# EAGLE design NodeArch_v2 (EAGLE 8.5.2)
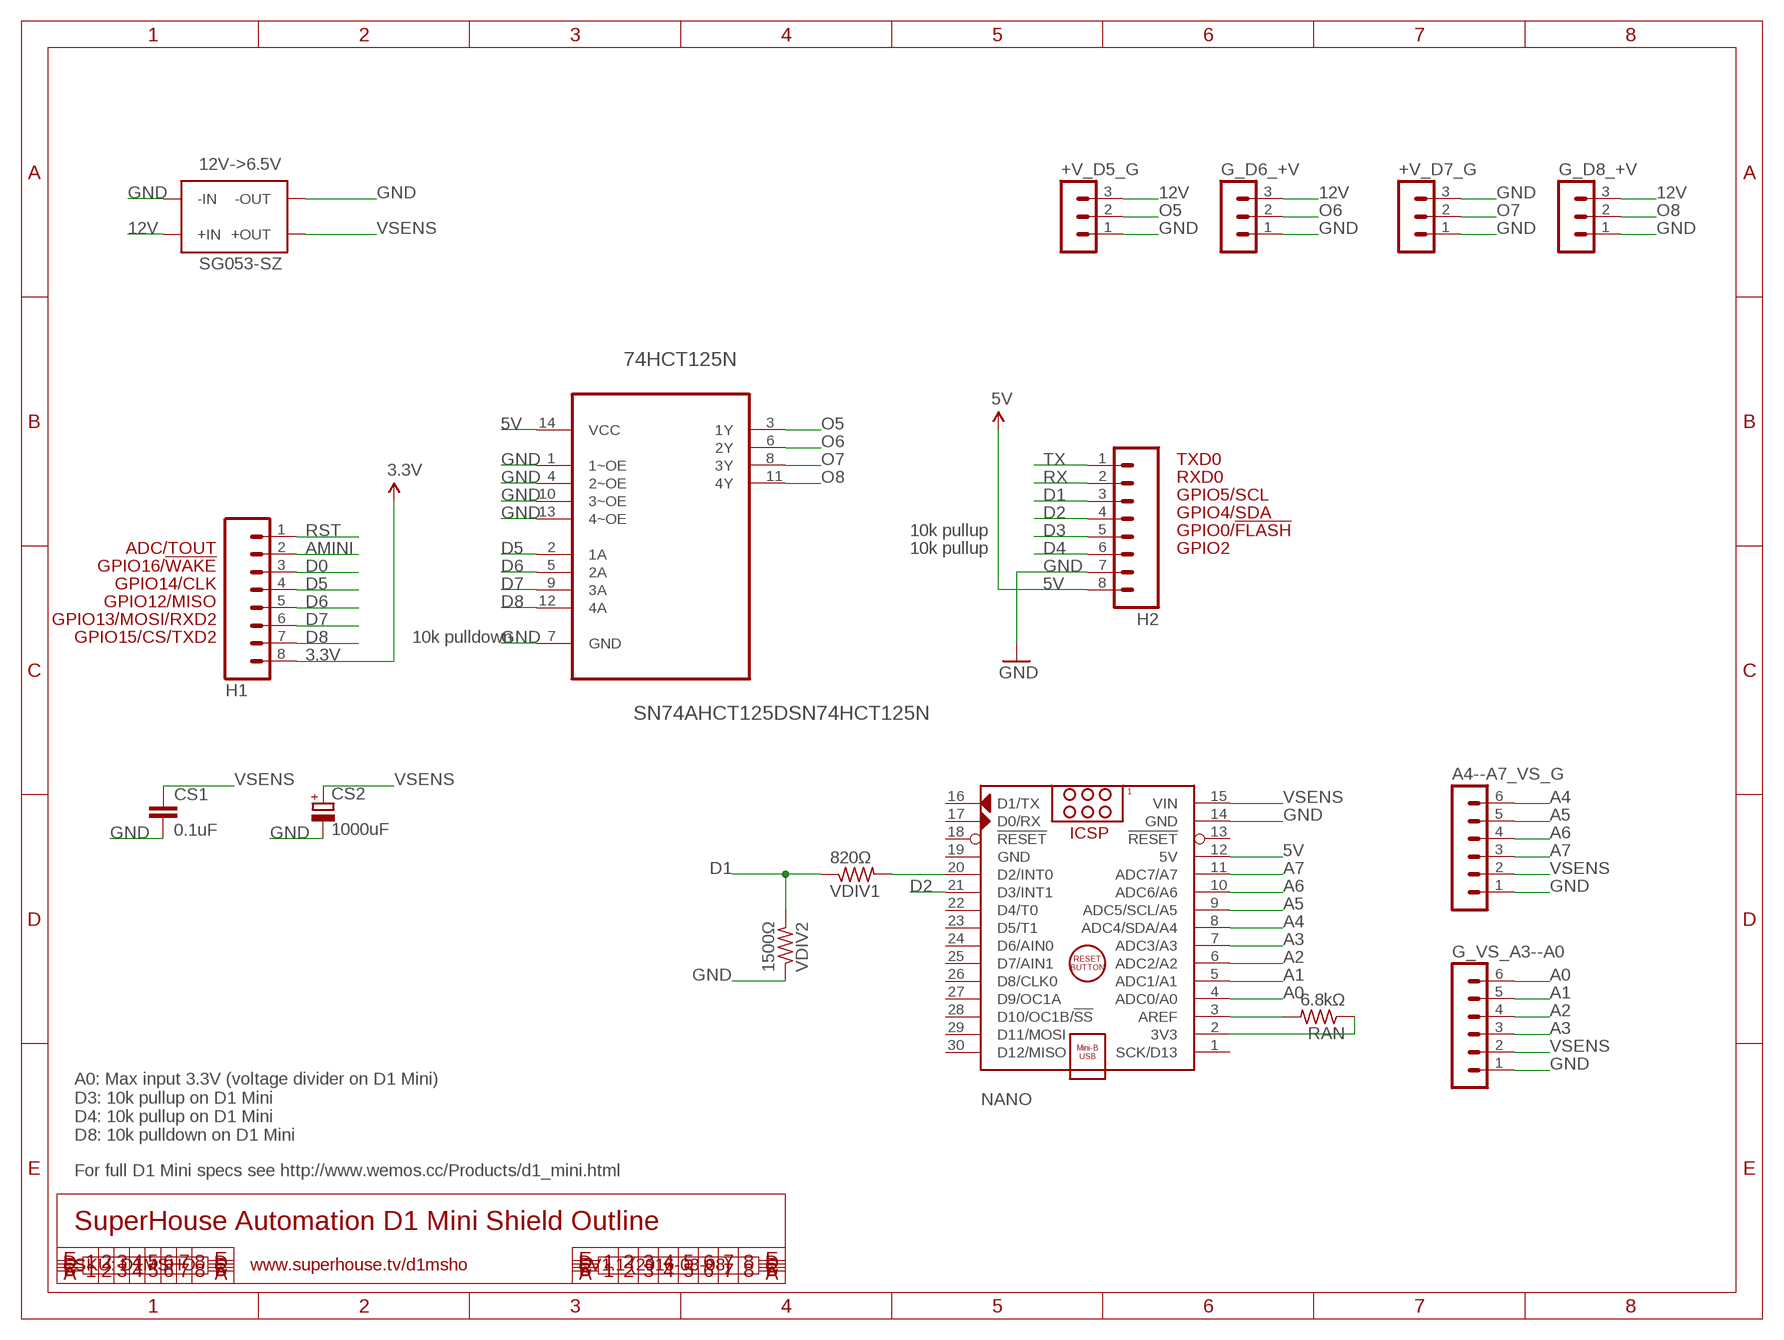
[diagram p0: schematic, sheet 1]

## Parts
12V->6.5V  SG053-SZ  [SG053-SZ]
74HCT125N  SN74AHCT125DSN74HCT125N  [DIP254P762X508-14]
+V_D5_G  MA03-1  [MA03-1]
+V_D7_G  MA03-1  [MA03-1]
A4--A7_VS_G  MA06-1  [MA06-1]
CS1  0.1uF  C-EU025-025X050  [C025-025X050]
CS2  1000uF  CPOL-EUE5-10.5  [E5-10,5]
G_D6_+V  MA03-1  [MA03-1]
G_D8_+V  MA03-1  [MA03-1]
G_VS_A3--A0  MA06-1  [MA06-1]
H1  M08  [1X08]
H2  M08  [1X08]
NANO  ARDUINO_NANO  [ARDUINO_NANO]
RAN  6.8kΩ  R-US_0207/2V  [0207/2V]
VDIV1  820Ω  R-US_0207/2V  [0207/2V]
VDIV2  1500Ω  R-US_0207/2V  [0207/2V]

## Nets
3.3V: H1.8
5V: 74HCT125N.14(VCC) H2.8 NANO.12(5V)
12V [power]: 12V->6.5V.P$3(+IN) 12V->6.5V.P$4(+IN) +V_D5_G.3 G_D6_+V.3 G_D8_+V.3
A0: G_VS_A3--A0.6 NANO.4(ADC0/A0)
A1: G_VS_A3--A0.5 NANO.5(ADC1/A1)
A2: G_VS_A3--A0.4 NANO.6(ADC2/A2)
A3: G_VS_A3--A0.3 NANO.7(ADC3/A3)
A4: A4--A7_VS_G.6 NANO.8(ADC4/SDA/A4)
A5: A4--A7_VS_G.5 NANO.9(ADC5/SCL/A5)
A6: A4--A7_VS_G.4 NANO.10(ADC6/A6)
A7: A4--A7_VS_G.3 NANO.11(ADC7/A7)
AMINI: H1.2
D0: H1.3
D1: H2.3 VDIV1.1 VDIV2.2
D2: H2.4 NANO.21(D3/INT1)
D3: H2.5
D4: H2.6
D5: 74HCT125N.2(1A) H1.4
D6: 74HCT125N.5(2A) H1.5
D7: 74HCT125N.9(3A) H1.6
D8: 74HCT125N.12(4A) H1.7
GND [power]: 12V->6.5V.P$1(-IN) 12V->6.5V.P$2(-IN) 12V->6.5V.P$7(-OUT) 12V->6.5V.P$8(-OUT) 74HCT125N.1(1~OE) 74HCT125N.4(2~OE) 74HCT125N.7(GND) 74HCT125N.10(3~OE) 74HCT125N.13(4~OE) +V_D5_G.1 +V_D7_G.1 +V_D7_G.3 A4--A7_VS_G.1 CS1.2 CS2.- G_D6_+V.1 G_D8_+V.1 G_VS_A3--A0.1 H2.7 NANO.14(GND) VDIV2.1
N$1: NANO.3(AREF) RAN.2
N$2: NANO.2(3V3) RAN.1
N$3: NANO.20(D2/INT0) VDIV1.2
O5: 74HCT125N.3(1Y) +V_D5_G.2
O6: 74HCT125N.6(2Y) G_D6_+V.2
O7: 74HCT125N.8(3Y) +V_D7_G.2
O8: 74HCT125N.11(4Y) G_D8_+V.2
RST: H1.1
RX: H2.2
TX: H2.1
VSENS: 12V->6.5V.P$5(+OUT) 12V->6.5V.P$6(+OUT) A4--A7_VS_G.2 CS1.1 CS2.+ G_VS_A3--A0.2 NANO.15(VIN)
Unconnected: NANO.1(SCK/D13) NANO.13(!RESET) NANO.16(D1/TX) NANO.17(D0/RX) NANO.18(!RESET) NANO.22(D4/T0) NANO.23(D5/T1) NANO.24(D6/AIN0) NANO.25(D7/AIN1) NANO.26(D8/CLK0) NANO.27(D9/OC1A) NANO.28(D10/OC1B/!SS) NANO.29(D11/MOSI) NANO.30(D12/MISO)

## Notes on the sheet
- TXD0
- RXD0
- GPIO5/SCL
- GPIO4/SDA
- 10k pullup | GPIO0/!FLASH
- ADC/TOUT | 10k pullup | GPIO2
- GPIO16/!WAKE
- GPIO14/CLK
- GPIO12/MISO
- GPIO13/MOSI/RXD2
- GPIO15/CS/TXD2 | 10k pulldown
- A0: Max input 3.3V (voltage divider on D1 Mini)
  D3: 10k pullup on D1 Mini
  D4: 10k pullup on D1 Mini
  D8: 10k pulldown on D1 Mini
- For full D1 Mini specs see http://www.wemos.cc/Products/d1_mini.html
- SuperHouse Automation D1 Mini Shield Outline
- SKU: D1MSHO | www.superhouse.tv/d1msho | V1.1 (2016-03-08)

## Power pins joined to a net without a drawn wire
GND: NANO.19(GND)

## Library data of the parts
12V->6.5V = 1484249208697-powermodules:SG053-SZ
74HCT125N = parts:SN74AHCT125D: QUADRUPLE BUS BUFFER GATES WITH 3-STATE OUTPUTS
+V_D5_G +V_D7_G G_D6_+V G_D8_+V = con-lstb:MA03-1: PIN HEADER; OC_FARNELL: unknown; OC_NEWARK: unknown
A4--A7_VS_G G_VS_A3--A0 = con-lstb:MA06-1: PIN HEADER; OC_FARNELL: unknown; OC_NEWARK: unknown
CS1 = rcl:C-EU: CAPACITOR, European symbol; SPICEPREFIX: C
CS2 = resistor:CPOL-EU: POLARIZED CAPACITOR, European symbol
H1 H2 = freetronics-original:M08: Header 8 Standard 8-pin 0.1" header. Use with straight break away headers (SKU : PRT-00116), right angle break away headers (PRT-00553), swiss pins (PRT-00743), machine pins (PRT-00117), and female headers (PRT-00115).
NANO = ArduinoNanoV30:ARDUINO_NANO: Arduino Nano V3.0 Module Overview: The Arduino Nano is a small, complete, and breadboard-friendly board based on the ATmega328 (Arduino Nano 3.x) or ATmega168 (Arduino Nano 2.x). It has more or less the same functionality of the Arduino Duemilanove, but in a different package. It lacks only a DC power jack, and works with a Mini-B USB cable instead of a standard one. The Nano was designed and is being produced by Gravitech <http://www.gravitech.us/arna30wiatp.html>. General specifications: Item Value Microcontroller Atmel ATmega168 or ATmega328 Operating Voltage (logic level) 5 V Input Voltage (recommended) 7-12 V Input Voltage (limits) 6-20 V Digital I/O Pins 14 (of which 6 provide PWM output) Analog Input Pins 8 DC Current per I/O Pin 40 mA Flash Memory 16 KB (ATmega168) or 32 KB (ATmega328) of which 2 KB used by bootloader SRAM 1 KB (ATmega168) or 2 KB (ATmega328) EEPROM 512 bytes (ATmega168) or 1 KB (ATmega328) Clock Speed 16 MHz Dimensions (Inches) 0.73" x 1.70" Dimensions (mm) 18mm x 45mm Overall height About 9 mm (not including pins) Weigth 5 g Power: The Arduino Nano can be powered via the Mini-B USB connection, 6-20V unregulated external power supply (pin 30), or 5V regulated external power supply (pin 27). The power source is automatically selected to the highest voltage source. Memory: The ATmega168 has 16 KB of flash memory for storing code (of which 2 KB is used for the bootloader); the ATmega328 has 32 KB, (also with 2 KB used for the bootloader). The ATmega168 has 1 KB of SRAM and 512 bytes of EEPROM (which can be read and written with the EEPROM library); the ATmega328 has 2 KB of SRAM and 1 KB of EEPROM. Input and Output: Each of the 14 digital pins on the Nano can be used as an input or output, using pinMode(), digitalWrite(), and digitalRead() functions. They operate at 5 volts. Each pin can provide or receive a maximum of 40 mA and has an internal pull-up resistor (disconnected by default) of 20-50 kOhms. In addition, some pins have specialized functions. Visit Arduino - ArduinoBoardNano <https://www.arduino.cc/en/Main/ArduinoBoardNano>
RAN VDIV1 VDIV2 = resistor:R-US_: RESISTOR, American symbol

## Net classes
0 default: width 0.203 mm, drill 0.356 mm, clearance 0.152 mm
1 power: width 0.762 mm, clearance 0.152 mm

## Board
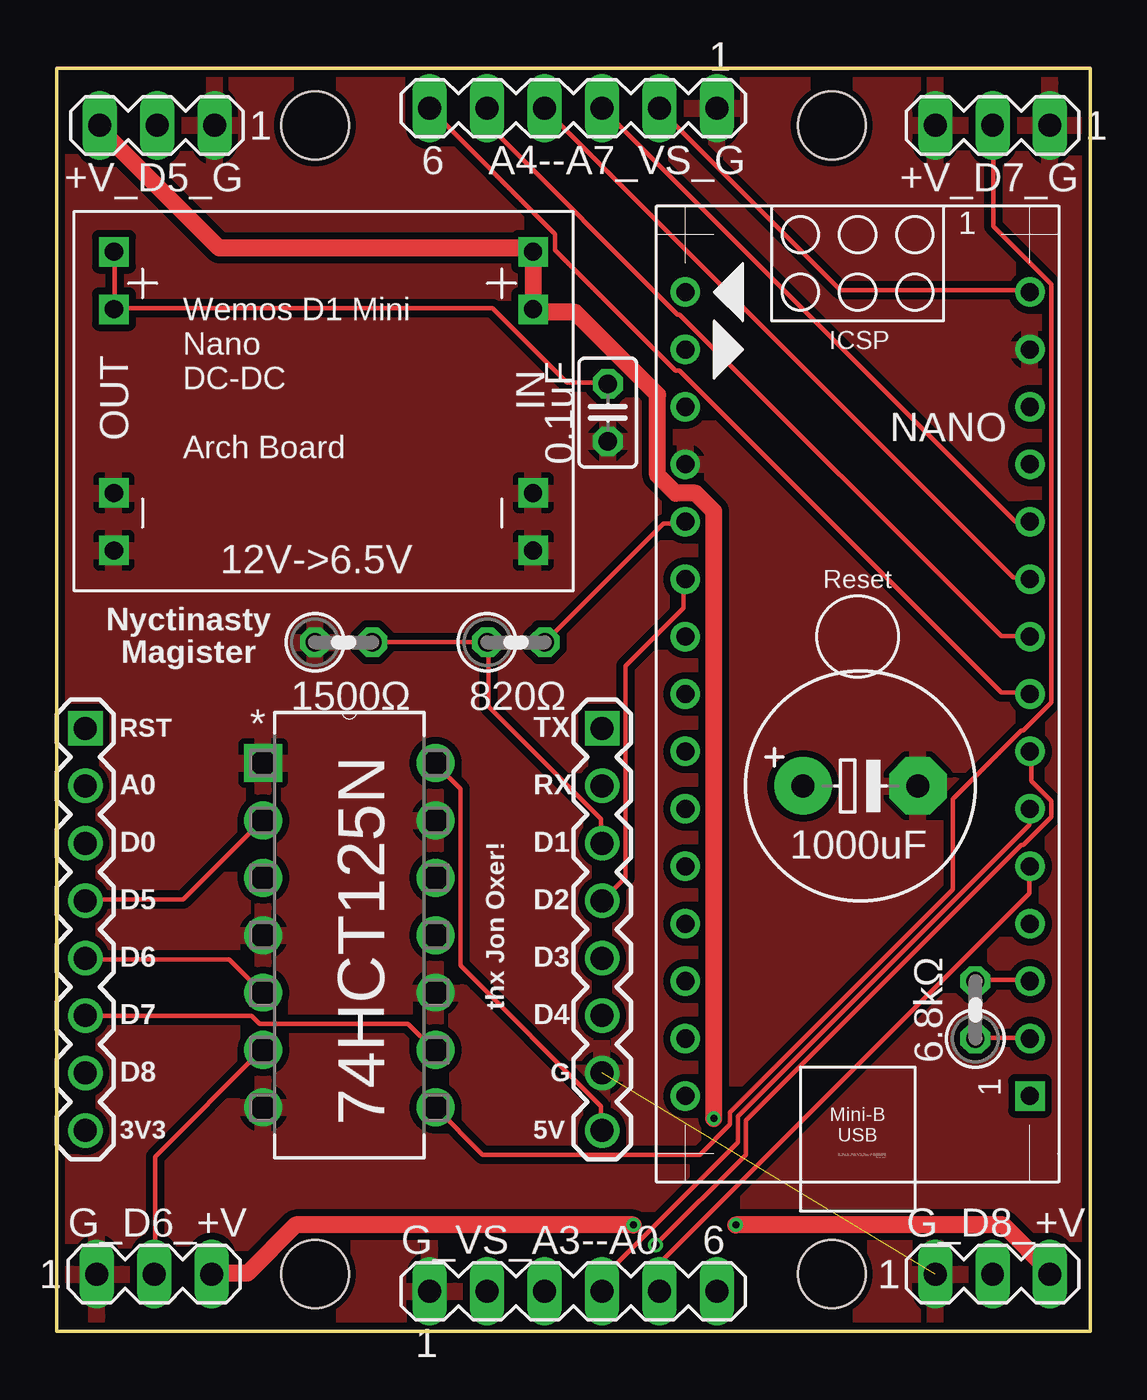
[diagram p1: board, top side]
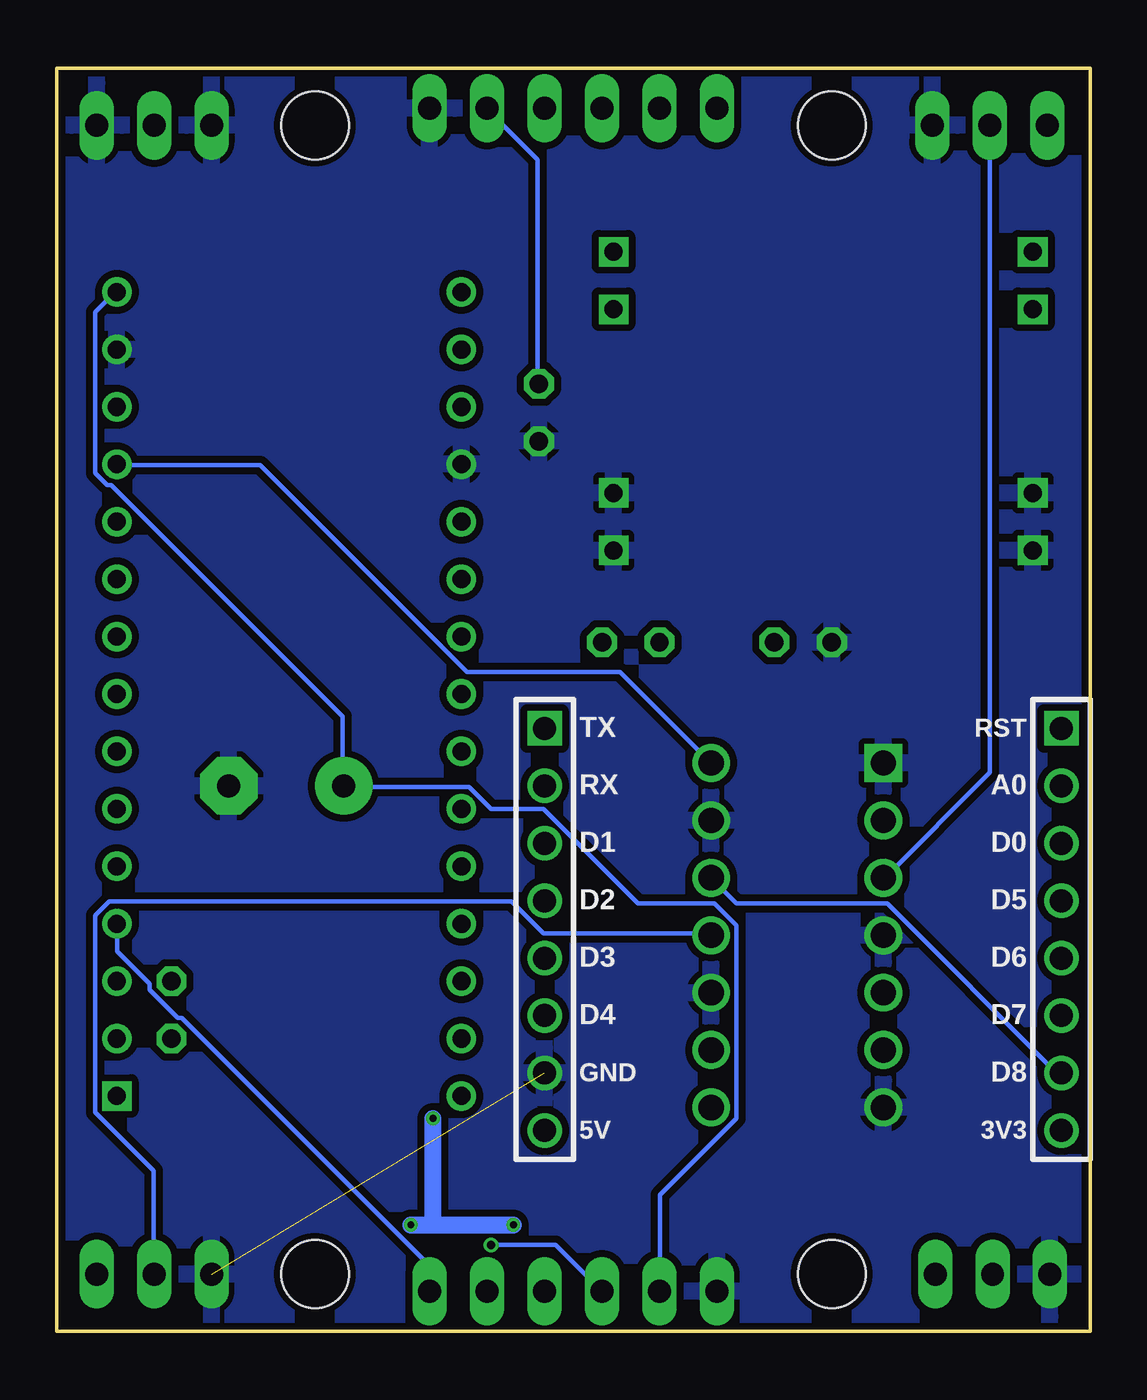
[diagram p2: board, bottom side, seen from below]

Size 45.72 x 55.88 mm. Coordinates in mm from the lower left corner, seen from the top.
Outline: 0,7.62 0,7.87
Outline: 0,0 0,55.88 45.72,55.88 45.72,0 0,0
Copper layers (1*16): Top 0.035mm / dielectric 1.5mm / Bottom 0.035mm
Design rules "ElectroDragon_2layer_DRU_no_angle_20140221": minimum track width 6mil, minimum drill 12mil, track to track 6mil, track to pad 6mil, pad to pad 6mil, via to via 6mil, smd to smd 6mil, copper to edge 8mil, drill to drill 6mil, minimum pad ring 10mil, minimum via ring 6mil, stop-mask expansion 4mil, vias tented up to drill 100mil, thermal gap 10mil
Holes 3 mm at 34.29,53.34 34.29,2.54 11.43,2.54 11.43,53.34

### Footprints (pad centres in the part's own frame; a part is rotated, then mirrored left to right if it is on the bottom)
SG053-SZ = drill 0.8 square: P$1 -8.382,6.096; P$2 -8.382,3.556; P$3 -8.382,-4.572; P$4 -8.382,-7.112; P$5 10.16,-7.112; P$6 10.16,-4.572; P$7 10.16,3.556; P$8 10.16,6.096
DIP254P762X508-14 = drill 1.118 square: 1 -7.62,15.24 | drill 1.118: 2 -7.62,12.7; 3 -7.62,10.16; 4 -7.62,7.62; 5 -7.62,5.08; 6 -7.62,2.54; 7 -7.62,0; 8 0,0; 9 0,2.54; 10 0,5.08; 11 0,7.62; 12 0,10.16; 13 0,12.7; 14 0,15.24
MA03-1 = drill 1.016 long: 1 -2.54,0; 2 0,0; 3 2.54,0
MA06-1 = drill 1.016 long: 1 -6.35,0; 2 -3.81,0; 3 -1.27,0; 4 1.27,0; 5 3.81,0; 6 6.35,0
C025-025X050 = drill 0.813 octagon: 1 -1.27,0; 2 1.27,0
E5-10,5 = drill 1.016 pad 2.54: + -2.54,0 | drill 1.016 pad 2.54 octagon: - 2.54,0
1X08 = drill 1.016 square: 1 0,0 | drill 1.016: 2 2.54,0; 3 5.08,0; 4 7.62,0; 5 10.16,0; 6 12.7,0; 7 15.24,0; 8 17.78,0
ARDUINO_NANO = drill 0.8 square: 1 -20.32,-7.62 | drill 0.8: 2 -17.78,-7.62; 3 -15.24,-7.62; 4 -12.7,-7.62; 5 -10.16,-7.62; 6 -7.62,-7.62; 7 -5.08,-7.62; 8 -2.54,-7.62; 9 0,-7.62; 10 2.54,-7.62; 11 5.08,-7.62; 12 7.62,-7.62; 13 10.16,-7.62; 14 12.7,-7.62; 15 15.24,-7.62; 16 15.24,7.62; 17 12.7,7.62; 18 10.16,7.62; 19 7.62,7.62; 20 5.08,7.62; 21 2.54,7.62; 22 0,7.62; 23 -2.54,7.62; 24 -5.08,7.62; 25 -7.62,7.62; 26 -10.16,7.62; 27 -12.7,7.62; 28 -15.24,7.62; 29 -17.78,7.62; 30 -20.32,7.62
0207/2V = drill 0.813 octagon: 1 -1.27,0; 2 1.27,0

### Placement (x,y rotation side)
12V->6.5V  12.7,40.64 180 top
74HCT125N  16.76,9.91 0 top
+V_D5_G  4.45,53.34 180 top
+V_D7_G  41.4,53.34 180 top
A4--A7_VS_G  22.86,54.1 180 top
CS1  24.38,40.64 270 top
CS2  35.56,24.13 0 top
G_D6_+V  4.32,2.54 0 top
G_D8_+V  41.4,2.54 0 top
G_VS_A3--A0  22.86,1.78 0 top
H1  1.27,26.67 270 top
H2  24.13,26.67 270 top
NANO  35.43,30.73 90 top
RAN  40.64,14.22 90 top
VDIV1  20.32,30.48 0 top
VDIV2  12.7,30.48 0 top

### Tracks (layer width: path | path; a pad name or v marks a point on that pad's centre or on a via)
5V
  Top 0.203: H2.8 24.09,8.89 24.09,9.96 17.87,16.18 17.87,24 16.8,25.07 74HCT125N.14
  Bottom 0.203: NANO.12 43.03,38.32 36.72,38.32 27.56,29.16 20.8,29.16 16.8,25.16 74HCT125N.14
12V  (via drill 0.3)
  Top 0.762: +V_D5_G.3 1.96,53.34 1.96,53.16 7.2,47.92 20.71,47.92 12V->6.5V.P$4 21.07,47.74 21.07,45.25 12V->6.5V.P$3 21.43,45.07 22.94,45.07 26.58,41.43 26.58,37.87 27.38,37.07 28.27,37.07 29.07,36.27 v29.07,9.42 | v25.51,4.71 10.58,4.71 8.45,2.58 6.93,2.58 G_D6_+V.3 | v30.05,4.71 41.87,4.71 44.01,2.58 G_D8_+V.3
  Bottom 0.762: v30.05,4.71 29.07,4.71 | 29.07,4.71 v25.51,4.71 | 29.07,4.71 v29.07,9.42
A0
  Bottom 0.203: NANO.4 43.03,17.96 43.03,16.8 41.6,15.38 41.6,15.11 40.36,13.87 40.18,13.87 29.25,2.93 29.25,1.78 G_VS_A3--A0.6
A1
  Top 0.203: G_VS_A3--A0.5 26.67,3.02 43.03,19.38 43.03,20.54 NANO.5
A2
  Top 0.203: NANO.6 43.03,23.11 43.03,22.4 30.14,9.51 30.14,8.36 24.18,2.4 24.18,1.78 G_VS_A3--A0.4
A3  (via drill 0.36)
  Top 0.203: v26.49,3.82 30.49,7.82 30.49,9.34 42.67,21.51 42.76,21.51 44.01,22.76 44.01,23.47 43.12,24.36 43.12,25.6 NANO.7
  Bottom 0.203: v26.49,3.82 23.65,3.82 21.6,1.78 G_VS_A3--A0.3
A4
  Top 0.203: NANO.8 43.03,28.27 41.78,28.27 27.56,42.49 27.38,42.49 22.05,47.83 22.05,48.54 16.54,54.05 A4--A7_VS_G.6
A5
  Top 0.203: NANO.9 43.03,30.76 41.78,30.76 27.56,44.98 27.47,44.98 19.11,53.34 19.11,54.05 A4--A7_VS_G.5
A6
  Top 0.203: NANO.10 43.03,33.34 42.32,33.34 21.6,54.05 A4--A7_VS_G.4
A7
  Top 0.203: A4--A7_VS_G.3 42.41,35.83 43.03,35.83 NANO.11
D1
  Top 0.203: VDIV2.2 14.05,30.49 19.02,30.49 VDIV1.1 19.11,30.4 19.11,27.65 24.09,22.67 24.09,21.6 H2.3
D2
  Top 0.203: NANO.21 27.74,33.25 27.74,32 25.16,29.43 25.16,20.09 24.18,19.11 H2.4
D5
  Top 0.203: H1.4 1.33,19.11 5.6,19.11 9.07,22.58 74HCT125N.2
D6
  Top 0.203: H1.5 1.33,16.45 7.64,16.45 9.07,15.02 74HCT125N.5
D7
  Top 0.203: H1.6 1.33,13.96 8.62,13.96 8.98,13.6 15.56,13.6 16.71,12.45 74HCT125N.9
D8
  Bottom 0.203: H1.7 1.33,11.47 1.51,11.47 8.98,18.94 15.65,18.94 16.71,20 74HCT125N.12
GND  (1 unrouted)
  pour Top (isolate 0.305): 0,0 0,55.88 45.72,55.88 45.72,0
  pour Bottom (isolate 0.305): 0,0 0,55.88 45.72,55.88 45.72,0
N$1
  Top 0.203: NANO.3 43.03,15.56 40.72,15.56 RAN.2
N$2
  Top 0.203: NANO.2 43.03,12.98 40.72,12.98 RAN.1
N$3
  Top 0.203: VDIV1.2 26.85,35.74 27.74,35.74 NANO.20
O5
  Bottom 0.203: +V_D5_G.2 4.45,24.71 9.07,20.09 74HCT125N.3
O6
  Top 0.203: G_D6_+V.2 4.36,2.58 4.36,7.73 9.07,12.45 74HCT125N.6
O7
  Top 0.203: 74HCT125N.8 18.85,7.82 28.45,7.82 29.78,9.16 29.78,9.69 39.65,19.56 39.65,23.56 42.67,26.58 42.76,26.58 44.01,27.83 44.01,46.32 41.43,48.9 41.43,53.34 +V_D7_G.2
O8
  Bottom 0.203: G_D8_+V.2 41.43,2.58 41.43,7.11 44.01,9.69 44.01,18.4 43.38,19.02 25.6,19.02 24.18,17.6 16.8,17.6 74HCT125N.11
VSENS
  Top 0.203: 12V->6.5V.P$5 2.58,47.74 2.58,45.25 12V->6.5V.P$6 2.67,45.25 19.29,45.25 22.58,41.96 24.36,41.96 CS1.1 | NANO.15 43.03,46.05 34.67,46.05 26.67,54.05 A4--A7_VS_G.2
  Bottom 0.203: G_VS_A3--A0.2 19.02,1.78 19.02,6.04 15.65,9.42 15.65,17.96 16.62,18.94 20,18.94 24.18,23.11 26.49,23.11 27.47,24.09 32.98,24.09 CS2.+ 33.07,24.18 33.07,27.2 43.29,37.43 43.47,37.43 44.01,37.96 44.01,45.07 43.12,45.96 NANO.15 | CS1.1 24.45,41.96 24.45,51.83 26.67,54.05 A4--A7_VS_G.2

### Text on the board
tPlace: Wemos D1 Mini / Nano / DC-DC / / Arch Board | Nyctinasty / Magister | RST | TX | A0 | RX | D0 | D1 | D5 | D2 | D6 | D3 | D7 | thx Jon Oxer! | D4 | D8 | G | 3V3 | 5V
bPlace: RST | TX | A0 | RX | D0 | D1 | D5 | D2 | D6 | D3 | D7 | D4 | D8 | GND | 3V3 | 5V